# Altium project BodyBasher.PrjPcb
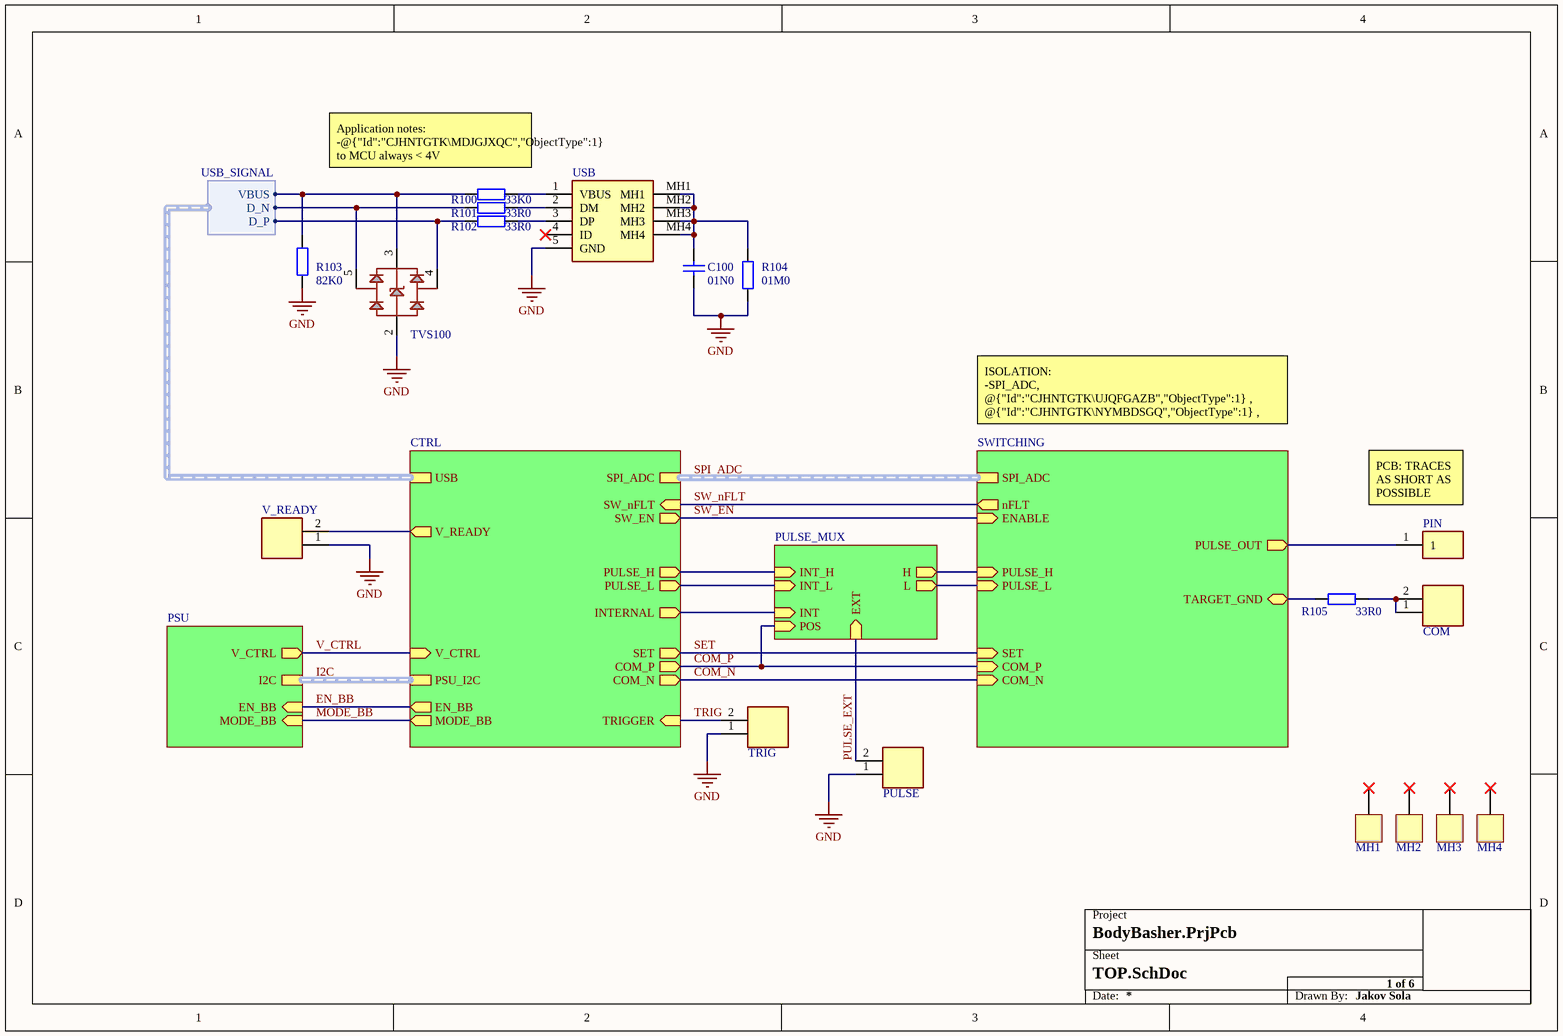
[diagram p0: TOP.SchDoc]
CAGE_CODE: ?????; CONTRACT_NUMBER: <CONTRACT NO>; DOC_NO_ASSY_DWG: <ASSY DWG NO>; DOC_NO_BOM: <BOM DOC NO>; DOC_NO_FAB_DWG: <FAB DWG NO>; DOC_NO_SCH_DWG: <SCH DWG NO>; PCB_2_DEC_TOL: +/-.01; PCB_3_DEC_TOL: +/-.010; PCB_ANG_TOL: +/-1/2; PCB_ASSEMBLY_NO: <PCB ASSY NO>; PCB_CHECKER: - -----; PCB_CHECKER_APP_DATE: --/--/----; PCB_DESIGNER: - -----; PCB_DESIGNER_APP_DATE: --/--/----; PCB_DWG_NO: <PCB DWG NO>; PCB_ENGINEER: - -----; PCB_ENGINEER_APP_DATE: --/--/----; PCB_PART_NUMBER: <PCB PN>; PCB_REV: A; SCH_REV: A
6 sheets, 158 parts. Net scope: hierarchical (ports join the sheet entries above them; power ports are global).
Board file: PCB.PcbDoc
Sheets:
  TOP.SchDoc
    SWITCHING = SWITCHING.SchDoc
      CAP_BANK = CAP_BANK.SchDoc
    PSU = PSU.SchDoc
    CTRL = CTRL.SchDoc
    PULSE_MUX = PULSE_MUX.SchDoc

## Sheet TOP.SchDoc: Body Basher
size A4; CompanyName: COSIC; DrawnBy: Jakov Sola; Engineer: Jakov Sola; SheetNumber: 1; SheetTotal: 6; ENG_APP_DATE: --/--/--; DSN_APP_DATE: --/--/--; CHK_APP_DATE: --/--/--

### Parts
C100  VALUE_4C: 01N0  [CAPC0805N]  (hidden comment: Cap)
COM  CON_2P  [2MMHBS02VT02HTB]  (value not drawn)
MH1  MH  [MH]  (value not drawn)  (no BOM)
MH2  MH  [MH]  (value not drawn)  (no BOM)
MH3  MH  [MH]  (value not drawn)  (no BOM)
MH4  MH  [MH]  (value not drawn)  (no BOM)
PIN  CON_1P  [POGO]  (value not drawn)
PULSE  CON_2P  [2MMHBS02VT02HTB]  (value not drawn)
R100  VALUE_4C: 33K0  [RESC0603N]  (hidden comment: Res)
R101  VALUE_4C: 33R0  [RESC0603N]  (hidden comment: Res)
R102  VALUE_4C: 33R0  [RESC0603N]  (hidden comment: Res)
R103  VALUE_4C: 82K0  [RESC0603N]  (hidden comment: Res)
R104  VALUE_4C: 01M0  [RESC0603N]  (hidden comment: Res)
R105  VALUE_4C: 33R0  [RESC0603N]  (hidden comment: Res)
TRIG  CON_2P  [2MMHBS02VT02HTB]  (value not drawn)
TVS100  SP3003_2X  [SC70_5]  (value not drawn)
USB  microUSB_CON  [476420001]  (value not drawn)
V_READY  CON_2P  [2MMHBS02VT02HTB]  (value not drawn)

### Sub-sheets
CTRL = CTRL.SchDoc: PULSE_H (out), PULSE_L (out), COM_P (out), COM_N (out), SET (out), SPI_ADC (harness SPI_ADC), TRIGGER (in), PSU_I2C (harness I2C), USB (harness USB_SIGNAL), MODE_BB (out), EN_BB (out), V_READY (out), SW_nFLT (in), SW_EN (out), INTERNAL (out), V_CTRL (in)
PSU = PSU.SchDoc: I2C (harness I2C), MODE_BB (in), EN_BB (in), V_CTRL (out)
PULSE_MUX = PULSE_MUX.SchDoc: INT_H (in), INT_L (in), EXT (in), H (out), L (out), INT (in), POS (in)
SWITCHING = SWITCHING.SchDoc: PULSE_H (in), PULSE_L (in), nFLT (out), ENABLE (in), PULSE_OUT (out), COM_P (in), COM_N (in), SET (in), TARGET_GND (bidir), SPI_ADC (harness SPI_ADC)

### Harnesses
USB_SIGNAL: D_P, D_N, VBUS

### Nets
COM: R105.1 ; sheet SWITCHING/TARGET_GND
GND: C100.1 PULSE.1 R103.1 R104.1 TRIG.1 TVS100.2 USB.5(GND) V_READY.1
SW: PIN.1 ; sheet SWITCHING/PULSE_OUT
V_CTRL: sheet PSU/V_CTRL, sheet CTRL/V_CTRL
COM_N: sheet SWITCHING/COM_N, sheet CTRL/COM_N
COM_P: sheet SWITCHING/COM_P, sheet CTRL/COM_P, sheet PULSE_MUX/POS
EN_BB: sheet PSU/EN_BB, sheet CTRL/EN_BB
INT: sheet CTRL/INTERNAL, sheet PULSE_MUX/INT
MODE_BB: sheet PSU/MODE_BB, sheet CTRL/MODE_BB
PULSE_EXT: PULSE.2 ; sheet PULSE_MUX/EXT
PULSE_H: sheet SWITCHING/PULSE_H, sheet CTRL/PULSE_H, sheet PULSE_MUX/INT_H, sheet PULSE_MUX/H
PULSE_L: sheet SWITCHING/PULSE_L, sheet CTRL/PULSE_L, sheet PULSE_MUX/INT_L, sheet PULSE_MUX/L
SET: sheet SWITCHING/SET, sheet CTRL/SET
SW_EN: sheet SWITCHING/ENABLE, sheet CTRL/SW_EN  [project net EN_SW]
SW_nFLT: sheet SWITCHING/nFLT, sheet CTRL/SW_nFLT  [project net nFLT]
TRIG: TRIG.2 ; sheet CTRL/TRIGGER
USB.D_N: R101.1 TVS100.5 ; sheet CTRL/USB.D_N
USB.D_P: R102.1 TVS100.4 ; sheet CTRL/USB.D_P
USB.VBUS: R100.2 R103.2 TVS100.3 ; sheet CTRL/USB.VBUS
V_READY: V_READY.2 ; sheet CTRL/V_READY
NetC100_2: C100.2 R104.2 USB.MH1 USB.MH2 USB.MH3 USB.MH4
NetCOM_1: COM.1 COM.2 R105.2
NetR100_1: R100.1 USB.1(VBUS)
NetR101_2: R101.2 USB.2(DM)
NetR102_2: R102.2 USB.3(DP)

Not connected (* = marked no-connect by the designer): MH1 0(MH)*; MH2 0(MH)*; MH3 0(MH)*; MH4 0(MH)*; USB 4(ID)*

### Buses and harness runs
harness I2C = sheet CTRL/PSU_I2C = sheet PSU/I2C
harness SPI_ADC = sheet CTRL/SPI_ADC = sheet SWITCHING/SPI_ADC

### Notes on the sheet
- Application notes:
  -@{"Id":"CJHNTGTK\MDJGJXQC","ObjectType":1} to MCU always < 4V
  -ESD protection
- ISOLATION:
  -SPI_ADC, @{"Id":"CJHNTGTK\UJQFGAZB","ObjectType":1} , @{"Id":"CJHNTGTK\NYMBDSGQ","ObjectType":1} , @{"Id":"CJHNTGTK\BMOAVTPZ","ObjectType":1} and @{"Id":"CJHNTGTK\TMLSETCT","ObjectType":1} isolated with ISOLATOR
  - @{"Id":"CJHNTGTK\TNVEIYGS","ObjectType":1} , @{"Id":"CJHNTGTK\KZAIASUD","ObjectType":1} and @{"Id":"CJHNTGTK\XAAZLINN","ObjectType":1} isolated with SSR inside SWITCHING
- (near PIN) PCB: TRACES AS SHORT AS POSSIBLE
- Project
- Sheet
- Date:
- Drawn By:

### Library data of the parts
C100 = 2238 600 15623: MANUF: PHYCOMP; DESCR: CAP 01N0 0805 100V X7R 10%; VENDOR: FARNELL INONE; VENDORCODE: 1362553; POPULATE: YES; VALUE_PF: 1000; VOLTAGE: 100V; TOLERANCE: 0.1; MANUFCODE: 2238 600 15623; PACKAGE: 0805; TECHNOLOGY: X7R
COM PULSE TRIG V_READY = 2MM-HB-S02-VT-02-H-TB: MANUF: TE CONNECTIVITY; DESCR: CON 2P 2MM HEADER; VENDOR: MOUSER; VENDORCODE: 571-2MM-HBS02VT02HTB; POPULATE: YES; MANUFCODE: 2MM-HB-S02-VT-02-H-TB
MH1-MH4 = MH: DESCR: MOUNTING HOLE; POPULATE: NA; MANUFCODE: MH
PIN = P25-0123: MANUF: HARWIN; DESCR: POGO PIN 15X5MM; VENDOR: MOUSER; VENDORCODE: 855-P25-0123; POPULATE: YES; MANUFCODE: P25-0123
R100 = CRCW060333K0FKEA: Resistor; MANUF: VISHAY; DESCR: RES 33K0 0603 0.1W 1% 75V 100PPM; VENDOR: DIGI-KEY; VENDORCODE: 541-33.0KHCT-ND; POPULATE: YES; VALUE_MOHM: 33000000; VALUE: 33K; POWER: 0.1W; TOLERANCE: 1%; VOLTAGE: 75V; TEMPCOEFF: 100PPM; NPOWER: 0.1; NTOLERANCE: 0.01; NVOLTAGE: 75; NTEMPCOEFF: 100; MANUFCODE: CRCW060333K0FKEA; PACKAGE: 0603; NVALUE: 33000000
R101 R102 R105 = CRCW060333R0FKEA: Resistor; MANUF: VISHAY; DESCR: RES 33R0 0603 0.1W 1% 75V 100PPM; VENDOR: DIGI-KEY; VENDORCODE: 541-33.0HCT-ND; POPULATE: YES; VALUE_MOHM: 33000; VALUE: 33R; POWER: 0.1W; TOLERANCE: 1%; VOLTAGE: 75V; TEMPCOEFF: 100PPM; NPOWER: 0.1; NTOLERANCE: 0.01; NVOLTAGE: 75; NTEMPCOEFF: 100; MANUFCODE: CRCW060333R0FKEA; PACKAGE: 0603; NVALUE: 33000
R103 = CRCW060382K0FKEA: Resistor; MANUF: VISHAY; DESCR: RES 82K0 0603 0.1W 1% 75V 100PPM; VENDOR: DIGI-KEY; VENDORCODE: 541-82.0KHCT-ND; POPULATE: YES; VALUE_MOHM: 82000000; VALUE: 82K; POWER: 0.1W; TOLERANCE: 1%; VOLTAGE: 75V; TEMPCOEFF: 100PPM; NPOWER: 0.1; NTOLERANCE: 0.01; NVOLTAGE: 75; NTEMPCOEFF: 100; MANUFCODE: CRCW060382K0FKEA; PACKAGE: 0603; NVALUE: 82000000
R104 = MC 0.063W 0603 1% 1M: Resistor; MANUF: MULTICOMP; DESCR: RES 01M0 0603 0.063W 1% 50V 100PPM; VENDOR: FARNELL INONE; VENDORCODE: 9330410; POPULATE: YES; VALUE_MOHM: 1000000000; VALUE: 1M; POWER: 0.063W; TOLERANCE: 1%; VOLTAGE: 50V; TEMPCOEFF: 100PPM; NPOWER: 0.063; NTOLERANCE: 0.01; NVOLTAGE: 50; NTEMPCOEFF: 100; MANUFCODE: MC 0.063W 0603 1% 1M; PACKAGE: 0603; NVALUE: 1000000000
TVS100 = SP3003-02JTG: MANUF: LITTELFUSE; DESCR: DIODE TVS DUAL 0.65PF SC70-5; VENDOR: DIGI-KEY; VENDORCODE: 1827640; POPULATE: YES; MANUFCODE: SP3003-02JTG; TYPE: TVS_BIDIR; QTY: DUAL; PACKAGE: SC70_5
USB = 47642-0001: MANUF: MOLEX; DESCR: CON MICRO USB 5P SMD; VENDOR: MOUSER; VENDORCODE: 538-47642-0001; POPULATE: YES; MANUFCODE: 47642-0001

## Sheet SWITCHING.SchDoc
size A4; DrawnBy: Jakov Sola; SheetNumber: 4; SheetTotal: 6
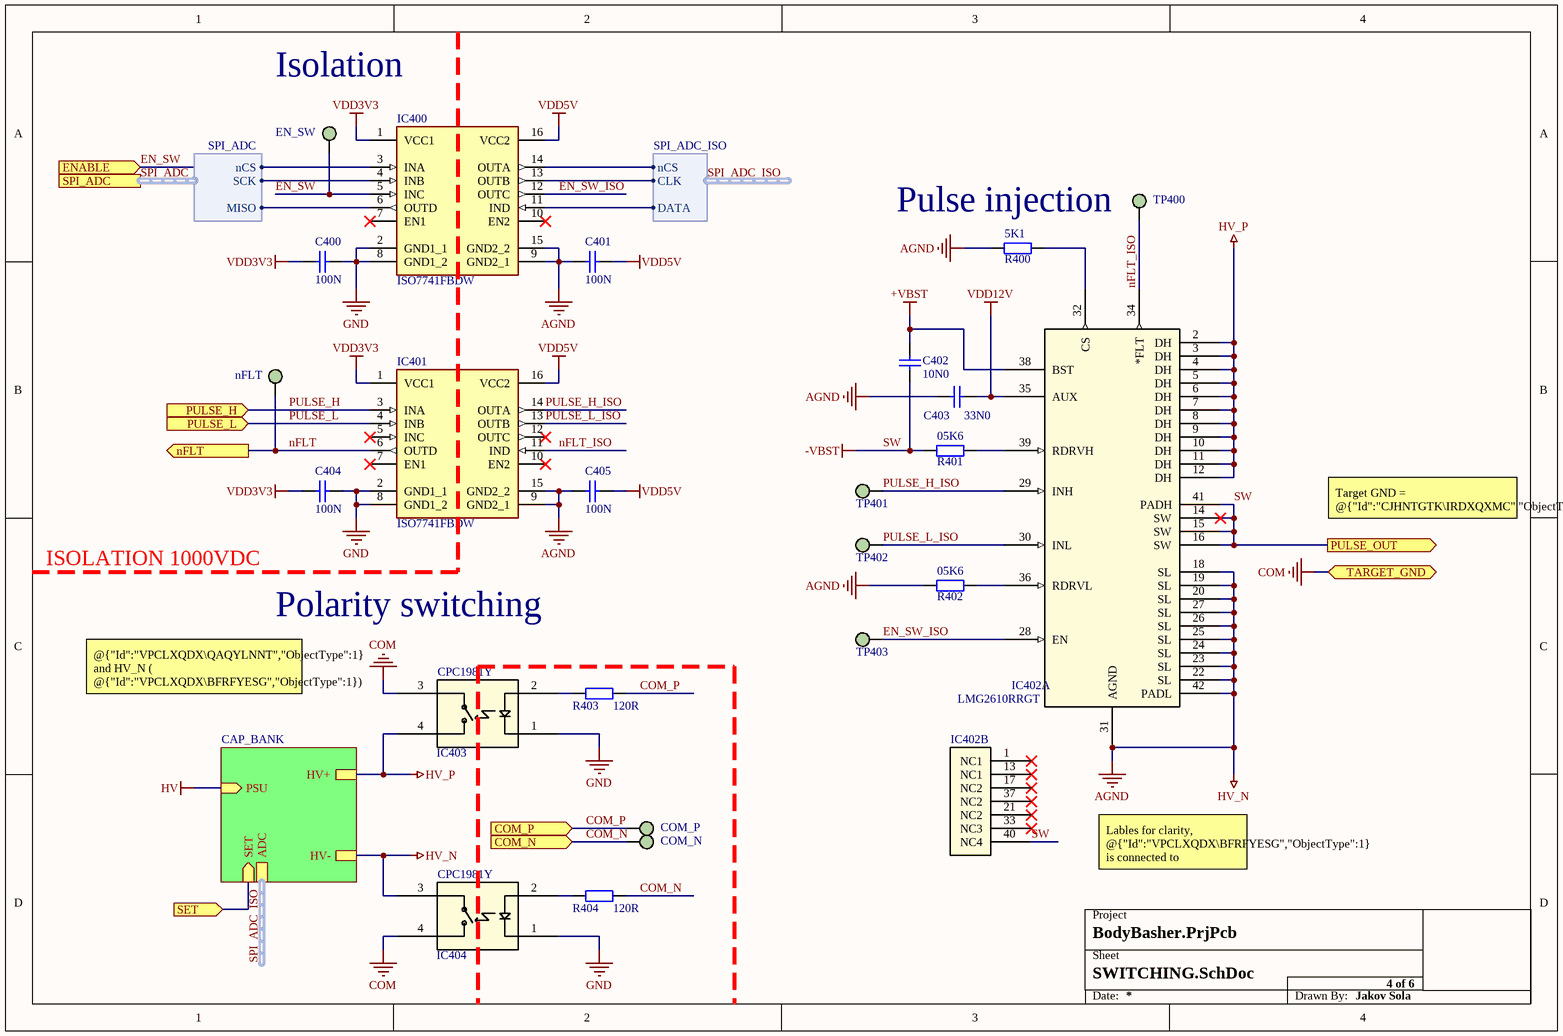
[diagram p1: SWITCHING.SchDoc]

### Parts
C400  VALUE_4C: 100N  [CAPC0603N]  (hidden comment: Cap)
C401  VALUE_4C: 100N  [CAPC0603N]  (hidden comment: Cap)
C402  VALUE_4C: 10N0  [CAPC0603N]  (hidden comment: Cap)
C403  VALUE_4C: 33N0  [CAPC0603N]  (hidden comment: Cap)
C404  VALUE_4C: 100N  [CAPC0603N]  (hidden comment: Cap)
C405  VALUE_4C: 100N  [CAPC0603N]  (hidden comment: Cap)
COM_N  TP  [TP]  (value not drawn)
COM_P  TP  [TP]  (value not drawn)
EN_SW  TP  [TP]  (value not drawn)
IC400  ISO7741FBDW  [SOIC16]
IC401  ISO7741FBDW  [SOIC16]
IC402  LMG2610RRGT  [XLMG2610RRGT]  (parts A,B of 2)
IC403  SSR_SPST_NO  [CPC1981Y]  (value not drawn)
IC404  SSR_SPST_NO  [CPC1981Y]  (value not drawn)
nFLT  TP  [TP]  (value not drawn)
R400  value 5K1  [RESC0603N]  (hidden comment: Res)
R401  VALUE_4C: 05K6  [RESC0603N]  (hidden comment: Res)
R402  VALUE_4C: 05K6  [RESC0603N]  (hidden comment: Res)
R403  VALUE_4C: 120R  [RESC0603N]  (hidden comment: Res)
R404  VALUE_4C: 120R  [RESC0603N]  (hidden comment: Res)
TP400  TP  [TP]  (value not drawn)
TP401  TP  [TP]  (value not drawn)
TP402  TP  [TP]  (value not drawn)
TP403  TP  [TP]  (value not drawn)

### Sub-sheets
CAP_BANK = CAP_BANK.SchDoc: PSU (in), ADC (harness SPI_ADC), SET (in), HV+, HV-

### Ports
COM_N (in), COM_P (in), ENABLE (in), nFLT (out), PULSE_H (in), PULSE_L (in), PULSE_OUT (out), SET (in), SPI_ADC (harness SPI_ADC), TARGET_GND (bidir)

### Harnesses
SPI_ADC_ISO: nCS, DATA, CLK
SPI_ADC: nCS, SCK, MISO

### Nets
+VBST: C402.2 IC402.38(BST)
AGND: C401.2 C403.1 C405.2 IC400.9(GND2_1) IC400.15(GND2_2) IC401.9(GND2_1) IC401.15(GND2_2) IC402.18(SL) IC402.19(SL) IC402.20(SL) IC402.22(SL) IC402.23(SL) IC402.24(SL) IC402.25(SL) IC402.26(SL) IC402.27(SL) IC402.31(AGND) IC402.42(PADL) IC404.3(NOCL1) R400.1 R402.1 ; sheet CAP_BANK/HV-  [also labelled HV_N]
COM: IC403.3(NOCL1) IC404.4(NOOP2) ; port TARGET_GND
GND: C400.1 C404.1 IC400.2(GND1_1) IC400.8(GND1_2) IC401.2(GND1_1) IC401.8(GND1_2) IC403.1(-) IC404.1(-)
HV_P: IC402.2(DH) IC402.3(DH) IC402.4(DH) IC402.5(DH) IC402.6(DH) IC402.7(DH) IC402.8(DH) IC402.9(DH) IC402.10(DH) IC402.11(DH) IC402.12(DH) IC403.4(NOOP2) ; sheet CAP_BANK/HV+
SW: C402.1 IC402.14(SW) IC402.15(SW) IC402.16(SW) IC402.40(NC4) IC402.41(PADH) R401.1 ; port PULSE_OUT  [also labelled -VBST]
VDD3V3: C400.2 C404.2 IC400.1(VCC1) IC401.1(VCC1)
VDD5V: C401.1 C405.1 IC400.16(VCC2) IC401.16(VCC2)
VDD12V: C403.2 IC402.35(AUX)
COM_N: COM_N.TP R404.2 ; port COM_N
COM_P: COM_P.TP R403.2 ; port COM_P
EN_SW: EN_SW.TP IC400.5(INC) ; port ENABLE
EN_SW_ISO: IC400.12(OUTC) IC402.28(EN) TP403.TP
nFLT: IC401.6(OUTD) nFLT.TP ; port nFLT
nFLT_ISO: IC401.11(IND) IC402.34(*FLT) TP400.TP
PULSE_H: IC401.3(INA) ; port PULSE_H
PULSE_H_ISO: IC401.14(OUTA) IC402.29(INH) TP401.TP
PULSE_L: IC401.4(INB) ; port PULSE_L
PULSE_L_ISO: IC401.13(OUTB) IC402.30(INL) TP402.TP
SET: port SET, sheet CAP_BANK/SET
SPI_ADC.MISO: IC400.6(OUTD) ; port SPI_ADC.MISO
SPI_ADC.nCS: IC400.3(INA) ; port SPI_ADC.nCS
SPI_ADC.SCK: IC400.4(INB) ; port SPI_ADC.SCK
SPI_ADC_ISO.CLK: IC400.13(OUTB) ; sheet CAP_BANK/ADC.CLK
SPI_ADC_ISO.DATA: IC400.11(IND) ; sheet CAP_BANK/ADC.DATA
SPI_ADC_ISO.nCS: IC400.14(OUTA) ; sheet CAP_BANK/ADC.nCS
NetIC402_32: IC402.32(CS) R400.2
NetIC402_36: IC402.36(RDRVL) R402.2
NetIC402_39: IC402.39(RDRVH) R401.2
NetIC403_2: IC403.2(+) R403.1
NetIC404_2: IC404.2(+) R404.1

Not connected (* = marked no-connect by the designer): IC400 7(EN1)* 10(EN2)*; IC401 5(INC)* 7(EN1)* 10(EN2)* 12(OUTC)*; IC402 1(NC1)* 13(NC1)* 17(NC2)* 21(NC2)* 33(NC3)* 37(NC2)*

### Buses and harness runs
harness SPI_ADC = port SPI_ADC
harness SPI_ADC_ISO = sheet CAP_BANK/ADC

### Notes on the sheet
- Isolation
- (near TP400) Pulse injection
- Target GND = @{"Id":"CJHNTGTK\IRDXQXMC","ObjectType":1}
  Keep traces as short as possible
- ISOLATION 1000VDC
- Polarity switching
- @{"Id":"VPCLXQDX\QAQYLNNT","ObjectType":1}  and HV_N ( @{"Id":"VPCLXQDX\BFRFYESG","ObjectType":1}) never connected to @{"Id":"CJHNTGTK\IRDXQXMC","ObjectType":1} at the same time
  Take into account t_on and t_off.
- Lables for clarity, @{"Id":"VPCLXQDX\BFRFYESG","ObjectType":1} is connected to @{"Id":"XTKKVGUJ\YZZHXVUT","ObjectType":2} in CAP_BANK
- Project
- Sheet
- Date:
- Drawn By:

### Library data of the parts
C400 C401 C404 C405 = CL10B104KA8WPNC: MANUF: SAMSUNG; DESCR: CAP 100N 0603 25V X7R 10%; VENDOR: DIGI-KEY; VENDORCODE: 1276-6717-1-ND; POPULATE: YES; VALUE: 100N; VOLTAGE: 25V; TOLERANCE: 0.1; MANUFCODE: CL10B104KA8WPNC; PACKAGE: 0603; TECHNOLOGY: X7R
C402 = CGA3E2C0G1H103J080AA: MANUF: TDK; DESCR: CAP 10N0 0603 50V NP0 5%; VENDOR: FARNELL INONE; VENDORCODE: 2210846; POPULATE: YES; VALUE_PF: 10000; VALUE: 10N; VOLTAGE: 50V; TOLERANCE: 0.05; MANUFCODE: CGA3E2C0G1H103J080AA; PACKAGE: 0603; TECHNOLOGY: NP0
C403 = CL10B333KB8NFNC: MANUF: SAMSUNG; DESCR: CAP 33N0 0603 50V X7R 10%; VENDOR: DIGI-KEY; VENDORCODE: 1276-2040-1-ND; POPULATE: YES; VALUE: 33N; VOLTAGE: 50V; TOLERANCE: 0.1; MANUFCODE: CL10B333KB8NFNC; PACKAGE: 0603; TECHNOLOGY: X7R
COM_N COM_P EN_SW nFLT TP400-TP403 = TP: DESCR: TESTPOINT 1.5MM; POPULATE: NA; MANUFCODE: TP
IC400 IC401 = ISO7741FBDW: MANUF: TI; DESCR: IC ISO 3/1 100MBPS 2.25-5.5 V; VENDOR: MOUSER; VENDORCODE: 595-ISO7741FBDW; POPULATE: YES; MANUFCODE: ISO7741FBDW
IC402 = LMG2610RRGT: MANUF: TEXAS INSTRUMENTS; DESCR: IC INT HALF BRIDGE GAN; VENDOR: MOUSER; VENDORCODE: 595-LMG2610RRGT; POPULATE: YES; MANUFCODE: LMG2610RRGT
IC403 IC404 = CPC1981Y: MANUF: IXYS; DESCR: IC SSR SPST NO 1000V 180mA; VENDOR: MOUSER; VENDORCODE: 849-CPC1981Y; POPULATE: YES; MANUFCODE: CPC1981Y
R400 = MC 0.063W 0603 1% 5K1: Resistor; MANUF: MULTICOMP; DESCR: RES 05K1 0603 0.063W 1% 50V 100PPM; VENDOR: FARNELL INONE; VENDORCODE: 9331301; POPULATE: YES; VALUE_MOHM: 5100000; VALUE_4C: 05K1; POWER: 0.063W; TOLERANCE: 1%; VOLTAGE: 50V; TEMPCOEFF: 100PPM; NPOWER: 0.063; NTOLERANCE: 0.01; NVOLTAGE: 50; NTEMPCOEFF: 100; MANUFCODE: MC 0.063W 0603 1% 5K1; PACKAGE: 0603; NVALUE: 5100000
R401 R402 = MC 0.063W 0603 1% 5K6: Resistor; MANUF: MULTICOMP; DESCR: RES 05K6 0603 0.063W 1% 50V 100PPM; VENDOR: FARNELL INONE; VENDORCODE: 9331352; POPULATE: YES; VALUE_MOHM: 5600000; VALUE: 5K6; POWER: 0.063W; TOLERANCE: 1%; VOLTAGE: 50V; TEMPCOEFF: 100PPM; NPOWER: 0.063; NTOLERANCE: 0.01; NVOLTAGE: 50; NTEMPCOEFF: 100; MANUFCODE: MC 0.063W 0603 1% 5K6; PACKAGE: 0603; NVALUE: 5600000
R403 R404 = CRCW0603120RFKEA: Resistor; MANUF: VISHAY; DESCR: RES 120R 0603 0.1W 1% 75V 100PPM; VENDOR: DIGI-KEY; VENDORCODE: 541-120HCT-ND; POPULATE: YES; VALUE_MOHM: 120000; VALUE: 120R; POWER: 0.1W; TOLERANCE: 1%; VOLTAGE: 75V; TEMPCOEFF: 100PPM; NPOWER: 0.1; NTOLERANCE: 0.01; NVOLTAGE: 75; NTEMPCOEFF: 100; MANUFCODE: CRCW0603120RFKEA; PACKAGE: 0603; NVALUE: 120000

## Sheet CAP_BANK.SchDoc
size A4; DrawnBy: Jakov Sola; SheetNumber: 5; SheetTotal: 6
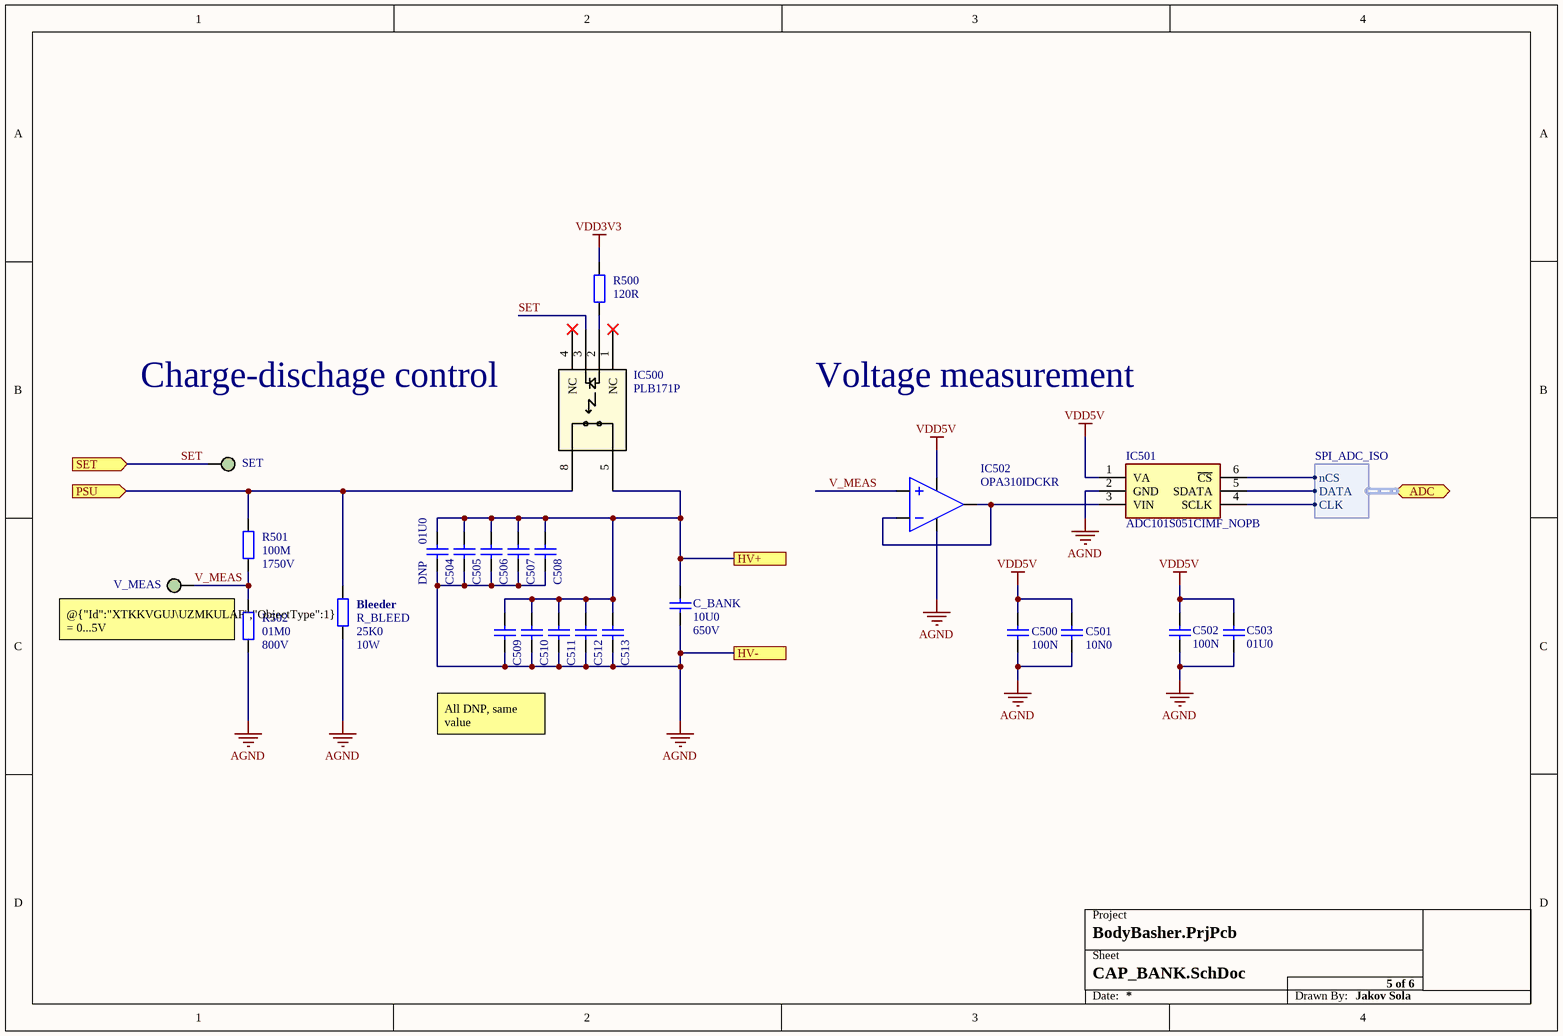
[diagram p2: CAP_BANK.SchDoc]

### Parts
C500  VALUE_4C: 100N  [CAPC0603N]  (hidden comment: Cap)
C501  VALUE_4C: 10N0  [CAPC0603N]  (hidden comment: Cap)
C502  VALUE_4C: 100N  [CAPC0603N]  (hidden comment: Cap)
C503  VALUE_4C: 01U0  [CAPC0603N]  (hidden comment: Cap)
C504  POPULATE: DNP  VALUE_4C: 01U0  [CAPC2220N]  (hidden comment: Cap)
C505  Cap  [CAPC2220N]  (value not drawn)
C506  Cap  [CAPC2220N]  (value not drawn)
C507  Cap  [CAPC2220N]  (value not drawn)
C508  Cap  [CAPC2220N]  (value not drawn)
C509  Cap  [CAPC2220N]  (value not drawn)
C510  Cap  [CAPC2220N]  (value not drawn)
C511  Cap  [CAPC2220N]  (value not drawn)
C512  Cap  [CAPC2220N]  (value not drawn)
C513  Cap  [CAPC2220N]  (value not drawn)
C_BANK  VALUE_4C: 10U0  VOLTAGE: 650V  [CAP_TH_15MM_RADIAL_30X58MM]  (hidden comment: Cap)
IC500  SSR_SPST_NC  [PLB171P]  (value not drawn)
IC501  ADC101S051CIMF_NOPB  [SOT95P280X145-6N]
IC502  OPA310IDCKR  [SOT65P210X110-5N]
R500  VALUE_4C: 120R  [RESC0603N]  (hidden comment: Res)
R501  VALUE_4C: 100M  VOLTAGE: 1750V  [RESC1210N]  (hidden comment: Res)
R502  VALUE_4C: 01M0  VOLTAGE: 800V  [RESC1210N]  (hidden comment: Res)
R_BLEED  VALUE_4C: 25K0  POWER: 10W  [RESAD8333W107L4521D953]  (hidden comment: Res)
SET  TP  [TP]  (value not drawn)
V_MEAS  TP  [TP]  (value not drawn)

### Ports
ADC (bidir, harness SPI_ADC_ISO), HV+, HV-, PSU (in), SET (in)

### Harnesses
SPI_ADC_ISO: nCS, DATA, CLK

### Nets
AGND: C500.2 C501.1 C502.2 C503.1 C504.1 C505.1 C506.1 C507.1 C508.1 C509.1 C510.1 C511.1 C512.1 C513.1 C_BANK.1 IC501.2(GND) IC502.2(V-) R502.1 R_BLEED.1 ; port HV-
HV: IC500.8(NOOP2) R501.2 R_BLEED.2 ; port PSU
HV_P: C504.2 C505.2 C506.2 C507.2 C508.2 C509.2 C510.2 C511.2 C512.2 C513.2 C_BANK.2 IC500.5(NOCL1) ; port HV+
VDD3V3: R500.2
VDD5V: C500.1 C501.2 C502.1 C503.2 IC501.1(VA) IC502.5(V+)
SET: IC500.3(-) SET.TP ; port SET
SPI_ADC_ISO.CLK: IC501.4(SCLK) ; port ADC.CLK
SPI_ADC_ISO.DATA: IC501.5(SDATA) ; port ADC.DATA
SPI_ADC_ISO.nCS: IC501.6(~{CS}) ; port ADC.nCS
V_MEAS: IC502.1(IN+) R501.1 R502.2 V_MEAS.TP
NetIC500_2: IC500.2(+) R500.1
NetIC501_3: IC501.3(VIN) IC502.3(IN-) IC502.4(OUT)

Not connected (* = marked no-connect by the designer): IC500 1(NC)* 4(NC)*

### Notes on the sheet
- (near IC500) Charge-dischage control
- Voltage measurement
- @{"Id":"XTKKVGUJ\UZMKULAF","ObjectType":1} = 0...5V
  Imax = 500V/101MOhm = 5uA
- (near R_BLEED) Bleeder
- All DNP, same value
- Project
- Sheet
- Date:
- Drawn By:

### Library data of the parts
C500 C502 = CL10B104KA8WPNC: as C400 on sheet SWITCHING; MANUFCODE: CL10B104KA8WPNC; PACKAGE: 0603; TECHNOLOGY: X7R
C501 = C0603C103K8RACTU: MANUF: KEMET; DESCR: CAP 10N0 0603 10V X7R 10%; VENDOR: DIGI-KEY; VENDORCODE: 399-11132-1-ND; POPULATE: YES; VALUE: 10N; VOLTAGE: 10V; TOLERANCE: 0.1; MANUFCODE: C0603C103K8RACTU; PACKAGE: 0603; TECHNOLOGY: X7R
C503 = C0603C105K3PAC: MANUF: KEMET; DESCR: CAP 01U0 0603 25V X5R 10%; VENDOR: FARNELL INONE; VENDORCODE: 1288202; POPULATE: YES; VALUE_PF: 1000000; VOLTAGE: 25V; TOLERANCE: 0.1; MANUFCODE: C0603C105K3PAC; PACKAGE: 0603; TECHNOLOGY: X5R
C504 = 2220CC105KAZ2A: MANUF: KOYCERA; DESCR: CAP 01U0 2220 600V X7R 10%; VENDOR: MOUSER; VENDORCODE: 581-2220CC105KAZ2A; VALUE_PF: 1000000; VALUE: 1U; VOLTAGE: 600V; TOLERANCE: 0.1; MANUFCODE: 2220CC105KAZ2A; PACKAGE: 2220; TECHNOLOGY: X7R
C505-C513 = 2220CC105KAZ2A: MANUF: KOYCERA; DESCR: CAP 01U0 2220 600V X7R 10%; VENDOR: MOUSER; VENDORCODE: 581-2220CC105KAZ2A; POPULATE: DNP; VALUE_PF: 1000000; VALUE: 1U; VALUE_4C: 01U0; VOLTAGE: 600V; TOLERANCE: 0.1; MANUFCODE: 2220CC105KAZ2A; PACKAGE: 2220; TECHNOLOGY: X7R
C_BANK = B32928A4106K000: MANUF: EPCOS; DESCR: CAP 10U 30X58 650V PP 10%; VENDOR: MOUSER; VENDORCODE: 871-B32928A4106K000; POPULATE: YES; VALUE_PF: 10000000; VALUE: 10U; TOLERANCE: 0.1; MANUFCODE: B32928A4106K000; PACKAGE: 30X58
IC500 = PLB171P: Solid State SPST-NC (1 Form B) 8-SMD (0.300", 7.62mm), 6 Leads; MANUF: IXYS; DESCR: IC SSR SPST NC 800V 80mA; VENDOR: MOUSER; VENDORCODE: 849-PLB171P; POPULATE: YES; MANUFCODE: PLB171P
IC501 = ADC101S051CIMF/NOPB: MANUF: TI; DESCR: IC ADC 10B 500KSPS SPI; VENDOR: MOUSER; VENDORCODE: 926-AD101S051CIMFNPB; POPULATE: YES; MANUFCODE: ADC101S051CIMF/NOPB
IC502 = OPA310IDCKR: MANUF: TI; DESCR: IC OPAMP 5.5V 3MHz; VENDOR: MOUSER; VENDORCODE: 595-OPA310IDCKR; POPULATE: YES; MANUFCODE: OPA310IDCKR
R500 = CRCW0603120RFKEA: as R403 on sheet SWITCHING; MANUFCODE: CRCW0603120RFKEA; PACKAGE: 0603; NVALUE: 120000
R501 = CRHA1210AF100MFKEF: Resistor; MANUF: VISHAY; DESCR: RES 100M 1210 0.45W 1% 1750V 100PPM; VENDOR: MOUSER; VENDORCODE: 71-CRHA1210A100MFKEF; POPULATE: YES; VALUE_MOHM: 10000000000; VALUE: 100M; POWER: 0.45W; TOLERANCE: 1%; TEMPCOEFF: 100PPM; NPOWER: 0.45; NTOLERANCE: 0.01; NVOLTAGE: 1750; NTEMPCOEFF: 100; MANUFCODE: CRHA1210AF100MFKEF; PACKAGE: 1210; NVALUE: 10000000000
R502 = RCV12061M00FKEAAT: Resistor; MANUF: VISHAY; DESCR: RES 1M 1210 0.25W 1% 800V 100PPM; VENDOR: MOUSER; VENDORCODE: 71-RCV12061M00FKEAAT; POPULATE: YES; VALUE_MOHM: 100000000; VALUE: 1M; POWER: 0.25W; TOLERANCE: 1%; TEMPCOEFF: 100PPM; NPOWER: 0.25; NTOLERANCE: 0.01; NVOLTAGE: 800; NTEMPCOEFF: 100; MANUFCODE: RCV12061M00FKEAAT; PACKAGE: 1210; NVALUE: 100000000
R_BLEED = RS01025K00FE73: Resistor; MANUF: VISHAY; DESCR: RES 25K AXIAL 10W 1% 20PPM; VENDOR: MOUSER; VENDORCODE: 71-RS01025K00FE73; POPULATE: YES; VALUE_MOHM: 25000000; VALUE: 25K; TOLERANCE: 1%; TEMPCOEFF: 20PPM; NPOWER: 10; NTOLERANCE: 0.01; NTEMPCOEFF: 20; MANUFCODE: RS01025K00FE73; PACKAGE: AXIAL; NVALUE: 25000000
SET V_MEAS = TP: DESCR: TESTPOINT 1.5MM; POPULATE: NA; MANUFCODE: TP

## Sheet PSU.SchDoc
size A4; DrawnBy: Jakov Sola; SheetNumber: 6; SheetTotal: 6
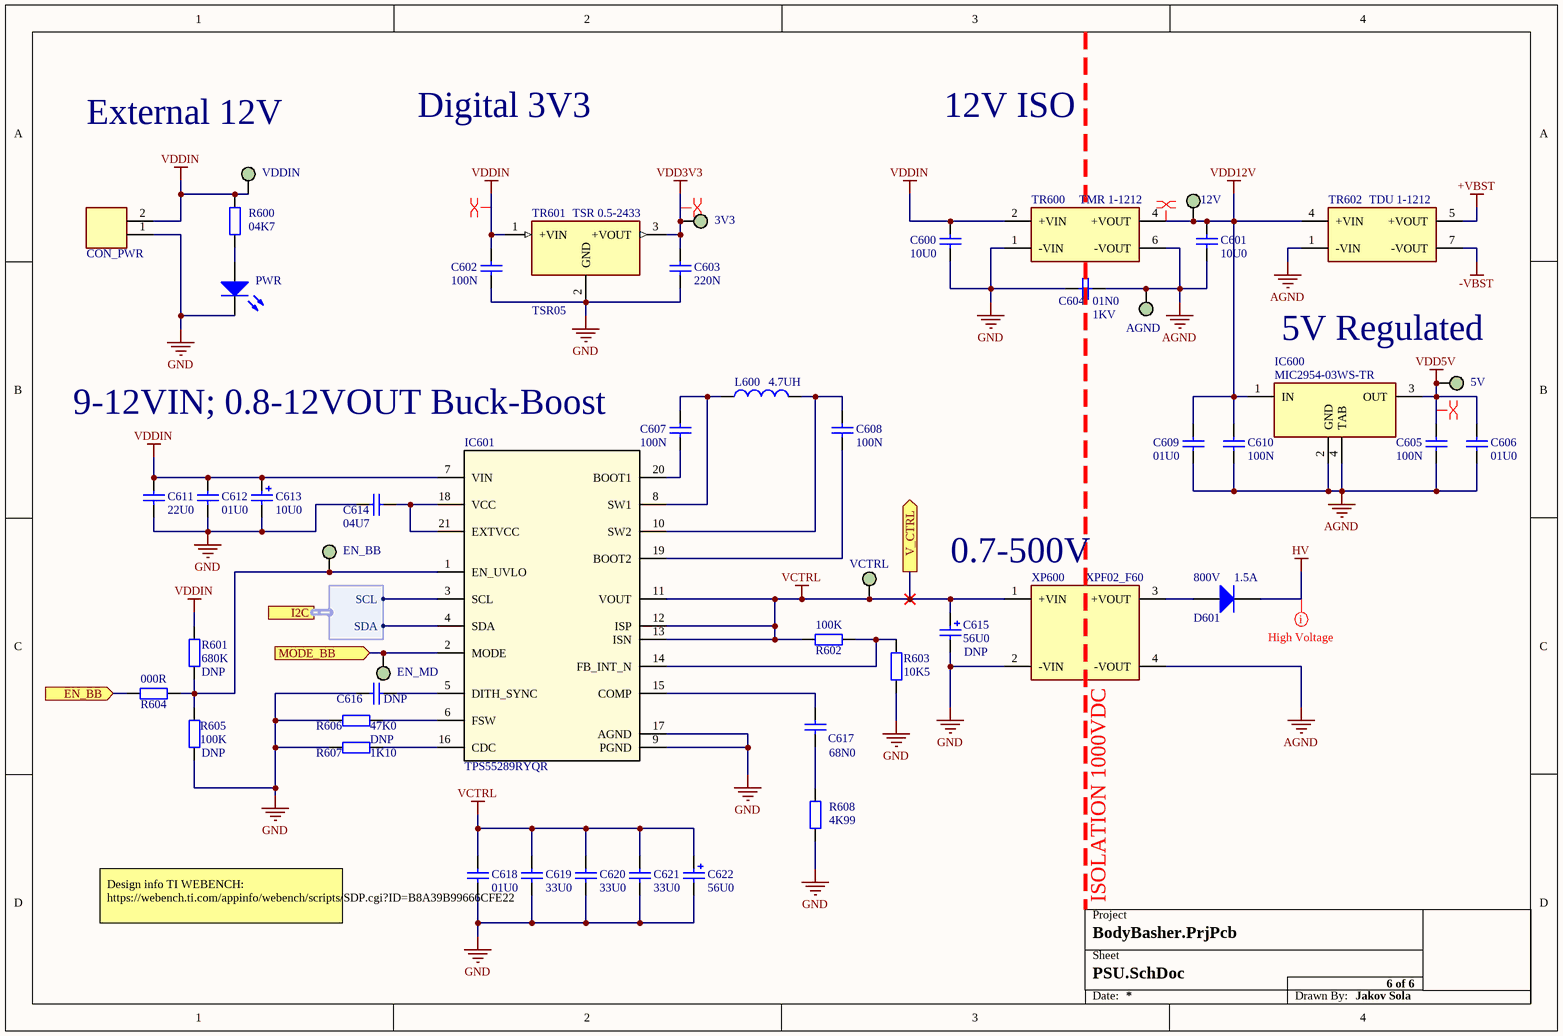
[diagram p3: PSU.SchDoc]

### Parts
3V3  TP  [TP]  (value not drawn)
5V  TP  [TP]  (value not drawn)
12V  TP  [TP]  (value not drawn)
AGND  TP  [TP]  (value not drawn)
C600  VALUE_4C: 10U0  [CAPC0603N]  (hidden comment: Cap)
C601  VALUE_4C: 10U0  [CAPC0603N]  (hidden comment: Cap)
C602  VALUE_4C: 100N  [CAPC0603N]  (hidden comment: Cap)
C603  VALUE_4C: 220N  [CAPC0603N]  (hidden comment: Cap)
C604  VALUE_4C: 01N0  VOLTAGE: 1KV  [CAPC1206N]  (hidden comment: Cap)
C605  VALUE_4C: 100N  [CAPC0603N]  (hidden comment: Cap)
C606  VALUE_4C: 01U0  [CAPC0603N]  (hidden comment: Cap)
C607  VALUE_4C: 100N  [CAPC0603N]  (hidden comment: Cap)
C608  VALUE_4C: 100N  [CAPC0603N]  (hidden comment: Cap)
C609  VALUE_4C: 01U0  [CAPC0603N]  (hidden comment: Cap)
C610  VALUE_4C: 100N  [CAPC0603N]  (hidden comment: Cap)
C611  VALUE_4C: 22U0  [CAPC1206N]  (hidden comment: Cap)
C612  VALUE_4C: 01U0  [CAPC0603N]  (hidden comment: Cap)
C613  VALUE_4C: 10U0  [C]  (hidden comment: CapPol)
C614  VALUE_4C: 04U7  [CAPC0603N]  (hidden comment: Cap)
C615  POPULATE: DNP  VALUE_4C: 56U0  [20SVPF56MX]  (hidden comment: CapPol)
C616  POPULATE: DNP  [CAPC0603N]  (hidden comment: Cap)
C617  VALUE_4C: 68N0  [CAPC0603N]  (hidden comment: Cap)
C618  VALUE_4C: 01U0  [CAPC0603N]  (hidden comment: Cap)
C619  VALUE_4C: 33U0  [CAPC1206N]  (hidden comment: Cap)
C620  VALUE_4C: 33U0  [CAPC1206N]  (hidden comment: Cap)
C621  VALUE_4C: 33U0  [CAPC1206N]  (hidden comment: Cap)
C622  VALUE_4C: 56U0  [20SVPF56MX]  (hidden comment: CapPol)
CON_PWR  CON_2P  [1711725]  (value not drawn)
D601  IF: 1.5A  VR: 800V  [DIOSMB]  (hidden comment: Diode)
EN_BB  TP  [TP]  (value not drawn)
EN_MD  TP  [TP]  (value not drawn)
IC600  MIC2954-03WS-TR  [SOT230P700X180-4N]
IC601  TPS55289RYQR  [RYQ0021A-MFG]
L600  INDUCTANCE: 4.7UH  [SRN80404R7Y]  (hidden comment: Inductor)
PWR  LED  [LED0603_GREEN]  (value not drawn)
R600  VALUE_4C: 04K7  [RESC0603N]  (hidden comment: Res)
R601  POPULATE: DNP  VALUE_4C: 680K  [RESC0603N]  (hidden comment: Res)
R602  VALUE_4C: 100K  [RESC0603N]  (hidden comment: Res)
R603  VALUE_4C: 10K5  [RESC0603N]  (hidden comment: Res)
R604  VALUE_4C: 000R  [RESC0603N]  (hidden comment: Res)
R605  POPULATE: DNP  VALUE_4C: 100K  [RESC0603N]  (hidden comment: Res)
R606  VALUE_4C: 47K0  [RESC0603N]  (hidden comment: Res)
R607  POPULATE: DNP  VALUE_4C: 1K10  [RESC0603N]  (hidden comment: Res)
R608  VALUE_4C: 4K99  [RESC0603N]  (hidden comment: Res)
TR600  MANUFCODE: TMR 1-1212  [TMR1]  (hidden comment: TMR1)
TR601  TSR05  MANUFCODE: TSR 0.5-2433  [TSR05]
TR602  MANUFCODE: TDU 1-1212  [TDU1]  (hidden comment: TDU1)
VCTRL  TP  [TP]  (value not drawn)
VDDIN  TP  [TP]  (value not drawn)
XP600  XPF02_F60  [XPF02_F60]

### Ports
EN_BB (in), I2C (harness I2C), MODE_BB (in), V_CTRL (out)

### Harnesses
I2C: SCL, SDA

### Nets
+VBST: TR602.5(+VOUT)
-VBST: TR602.7(-VOUT)  [project net SW]
AGND: AGND.TP C601.1 C604.2 C605.1 C606.1 C609.1 C610.1 IC600.2(GND) IC600.4(TAB) TR600.6(-VOUT) TR602.1(-VIN) XP600.4(-VOUT)
GND: C600.1 C602.1 C603.1 C604.1 C611.1 C612.1 C613.2 C614.1 C615.2 C616.2 C618.1 C619.1 C620.1 C621.1 C622.2 CON_PWR.1 IC601.9(PGND) IC601.17(AGND) PWR.2(K) R603.2 R605.1 R606.2 R607.1 R608.1 TR600.1(-VIN) TR601.2(GND) XP600.2(-VIN)
HV: D601.2(K)
VCTRL: C615.1 C618.2 C619.2 C620.2 C621.2 C622.1 IC601.11(VOUT) IC601.12(ISP) IC601.13(ISN) R602.1 VCTRL.TP XP600.1(+VIN) ; port V_CTRL  [project net V_CTRL]
VDD3V3: 3V3.TP C603.2 TR601.3(+VOUT)
VDD5V: 5V.TP C605.2 C606.2 IC600.3(OUT)
VDD12V: 12V.TP C601.2 C609.2 C610.2 IC600.1(IN) TR600.4(+VOUT) TR602.4(+VIN)
VDDIN: C600.2 C602.2 C611.2 C612.2 C613.1 CON_PWR.2 IC601.7(VIN) R600.2 R601.2 TR600.2(+VIN) TR601.1(+VIN) VDDIN.TP
EN_BB: R604.1 ; port EN_BB
I2C.SCL: IC601.3(SCL) ; port I2C.SCL
I2C.SDA: IC601.4(SDA) ; port I2C.SDA
MODE_BB: EN_MD.TP IC601.2(MODE) ; port MODE_BB
NetC607_1: C607.1 IC601.20(BOOT1)
NetC607_2: C607.2 IC601.8(SW1) L600.1
NetC608_1: C608.1 IC601.19(BOOT2)
NetC608_2: C608.2 IC601.10(SW2) L600.2
NetC614_2: C614.2 IC601.18(VCC) IC601.21(EXTVCC)
NetC616_1: C616.1 IC601.5(DITH_SYNC)
NetC617_1: C617.1 R608.2
NetC617_2: C617.2 IC601.15(COMP)
NetD601_1: D601.1(A) XP600.3(+VOUT)
NetEN_BB_TP: EN_BB.TP IC601.1(EN_UVLO) R601.1 R604.2 R605.2
NetIC601_6: IC601.6(FSW) R606.1
NetIC601_14: IC601.14(FB_INT_N) R602.2 R603.1
NetIC601_16: IC601.16(CDC) R607.2
NetPWR_1: PWR.1(A) R600.1

### Layout directives
mark named High Voltage: HV
rule Supply Nets [Voltage = 3.300]: VDD3V3, VDD5V
rule Supply Nets [Voltage = 12.00]: VDDIN
rule Supply Nets [Voltage = 5.000]: VDD12V

### Notes on the sheet
- External 12V
- Digital 3V3
- 12V ISO
- 5V Regulated
- 9-12VIN; 0.8-12VOUT Buck-Boost
- (near XP600) 0.7-500V
- Design info TI WEBENCH:
  https://webench.ti.com/appinfo/webench/scripts/SDP.cgi?ID=B8A39B99666CFE22
- (near XP600) ISOLATION 1000VDC
- Project
- Sheet
- Date:
- Drawn By:

### Library data of the parts
3V3 5V 12V AGND EN_BB EN_MD VCTRL VDDIN = TP: DESCR: TESTPOINT 1.5MM; POPULATE: NA; MANUFCODE: TP
C600 C601 = ZRB18AR61E106ME01L: MANUF: MURATA; DESCR: CAP 10U0 0603 25V X5R 20%; VENDOR: FARNELL INONE; VENDORCODE: 2469398; POPULATE: YES; VALUE_PF: 10000000; VALUE: 10U; VOLTAGE: 25V; TOLERANCE: 0.2; MANUFCODE: ZRB18AR61E106ME01L; PACKAGE: 0603; TECHNOLOGY: X5R
C602 C605 C607 C608 C610 = CL10B104KA8WPNC: as C400 on sheet SWITCHING; MANUFCODE: CL10B104KA8WPNC; PACKAGE: 0603; TECHNOLOGY: X7R
C603 = AC0603KRX7R6BB224: MANUF: YAGEO; DESCR: CAP 220N 0603 10V X7R 10%; VENDOR: DIGI-KEY; VENDORCODE: 311-3103-1-ND; POPULATE: YES; VALUE: 220N; VOLTAGE: 10V; TOLERANCE: 0.1; MANUFCODE: AC0603KRX7R6BB224; PACKAGE: 0603; TECHNOLOGY: X7R
C604 = 1206AC102KAT2A: MANUF: AVX; DESCR: CAP 01N0 1206 1KV X7R 10%; VENDOR: FARNELL INONE; VENDORCODE: 1216463; POPULATE: YES; VALUE_PF: 1000; TOLERANCE: 0.1; MANUFCODE: 1206AC102KAT2A; PACKAGE: 1206; TECHNOLOGY: X7R
C606 C609 = C0603C105K4PAC-TU: MANUF: KEMET; DESCR: CAP 01U0 0603 16V X5R 10%; VENDOR: FARNELL INONE; VENDORCODE: 1463388; POPULATE: YES; VALUE_PF: 1000000; VOLTAGE: 16V; TOLERANCE: 0.1; MANUFCODE: C0603C105K4PAC-TU; PACKAGE: 0603; TECHNOLOGY: X5R
C611 = CL31A226KAHNNNE: MANUF: SAMSUNG; DESCR: CAP 22U0 1206 25V X5R 10%; VENDOR: MOUSER; VENDORCODE: 187-CL31A226KAHNNNE; POPULATE: YES; VALUE_PF: 22000000; VALUE: 22U0; VOLTAGE: 25V; TOLERANCE: 0.1; MANUFCODE: CL31A226KAHNNNE; PACKAGE: 1206; TECHNOLOGY: X5R
C612 C618 = C0603C105K3PAC: as C503 on sheet CAP_BANK; MANUFCODE: C0603C105K3PAC; PACKAGE: 0603; TECHNOLOGY: X5R
C613 = TAJC106K025RNJ: MANUF: AVX; DESCR: CAP 10U0 C 25V TANT 10%; VENDOR: FARNELL INONE; VENDORCODE: 197518; POPULATE: YES; VALUE_PF: 10000000; VALUE: 10U; VOLTAGE: 25V; TOLERANCE: 0.1; MANUFCODE: TAJC106K025RNJ; PACKAGE: C; TECHNOLOGY: TANT
C614 = GRM185R61C475KE11D: MANUF: MURATA; DESCR: CAP 04U7 0603 16V X5R 10%; VENDOR: DIGI-KEY; VENDORCODE: 490-14459-1-ND; POPULATE: YES; VALUE_PF: 4700000; VALUE: 04U7; VOLTAGE: 16V; TOLERANCE: 0.1; MANUFCODE: GRM185R61C475KE11D; PACKAGE: 603; TECHNOLOGY: X5R
C615 = 20SVPF56MX: MANUF: PANASONIC; DESCR: CAP 56U0 5X5.9 20V 20%; VENDOR: MOUSER; VENDORCODE: 667-20SVPF56MX; VALUE_PF: 56000000; VALUE: 56U; VOLTAGE: 20V; TOLERANCE: 0.2; MANUFCODE: 20SVPF56MX; PACKAGE: 5X5.9
C616 = C0603C105K3PAC: MANUF: KEMET; DESCR: CAP 01U0 0603 25V X5R 10%; VENDOR: FARNELL INONE; VENDORCODE: 1288202; VALUE_PF: 1000000; VALUE_4C: 01U0; VOLTAGE: 25V; TOLERANCE: 0.1; MANUFCODE: C0603C105K3PAC; PACKAGE: 0603; TECHNOLOGY: X5R
C617 = C0603C683K8RACTU: MANUF: KEMET; DESCR: CAP 68N0 0603 10V X7R 10%; VENDOR: DIGI-KEY; VENDORCODE: 399-9122-1-ND; POPULATE: YES; VALUE: 68N; VOLTAGE: 10V; TOLERANCE: 0.1; MANUFCODE: C0603C683K8RACTU; PACKAGE: 0603; TECHNOLOGY: X7R
C619-C621 = C3216X5R1E336M160AC: MANUF: TDK; DESCR: CAP 33U0 1206 25V X5R 20%; VENDOR: MOUSER; VENDORCODE: 810-C3216X5R1E336M; POPULATE: YES; VALUE_PF: 33000000; VALUE: 33U; VOLTAGE: 25V; TOLERANCE: 0.2; MANUFCODE: C3216X5R1E336M160AC; PACKAGE: 1206; TECHNOLOGY: X5R
C622 = 20SVPF56MX: MANUF: PANASONIC; DESCR: CAP 56U0 5X5.9 20V 20%; VENDOR: MOUSER; VENDORCODE: 667-20SVPF56MX; POPULATE: YES; VALUE_PF: 56000000; VALUE: 56U; VOLTAGE: 20V; TOLERANCE: 0.2; MANUFCODE: 20SVPF56MX; PACKAGE: 5X5.9
CON_PWR = 1711725: MANUF: PHOENIX CONTACT; DESCR: CON PHOENIX 5.08MM 2P SCREW; VENDOR: MOUSER; VENDORCODE: 651-1711725; POPULATE: YES; MANUFCODE: 1711725
D601 = RS2K-E3/52T: Default Diode; MANUF: VISHAY; DESCR: DIODE 800V 1.5A SMB; VENDOR: MOUSER; VENDORCODE: 625-RS2K-E3; POPULATE: YES; MANUFCODE: RS2K-E3/52T; QTY: SINGLE; PACKAGE: SMB
IC600 = MIC2954-03WS-TR: MANUF: MICROCHIP; DESCR: IC LDO 2-30VIN 5VOUT 250mA; VENDOR: MOUSER; VENDORCODE: 998-MIC2954-03WSTR; POPULATE: YES; MANUFCODE: MIC2954-03WS-TR
IC601 = TPS55289RYQR: MANUF: TI; DESCR: IC BUCK-BOOST 30V 8A I2C; VENDOR: MOUSER; VENDORCODE: 595-TPS55289RYQR; POPULATE: YES; MANUFCODE: TPS55289RYQR
L600 = SRN8040-4R7Y: MANUF: BOURNS; DESCR: INDUCTOR 04U7 4A1 R024 SMD; VENDOR: MOUSER; VENDORCODE: 652-SRN8040-4R7Y; POPULATE: YES; VALUE: 04U7; IMAX: 4A1; RESISTANCE: R024; MANUFCODE: SRN8040-4R7Y; TYPE: INDUCTOR
PWR = ASMT-RF45: MANUF: AVAGO TECHNOLOGIES; DESCR: LED GREEN 0603 20MA 2.4V 60MCD; VENDOR: FARNELL INONE; VENDORCODE: 1652078; POPULATE: YES; REMARK: GREEN; IF: 20MA; VF: 2.4V; INTENSITY: 60MCD; MANUFCODE: ASMT-RF45; QTY: SINGLE; COLOR: GREEN; PACKAGE: 0603
R600 = CRCW06034K70JNEAC: Resistor; MANUF: VISHAY; DESCR: RES 04K7 0603 0.1W 5% 75V 200PPM; VENDOR: DIGI-KEY; VENDORCODE: 541-3993-1-ND; POPULATE: YES; VALUE_MOHM: 4700000; VALUE: 04K7; POWER: 0.1W; TOLERANCE: 5%; VOLTAGE: 75V; TEMPCOEFF: 200PPM; NPOWER: 0.1; NTOLERANCE: 0.05; NVOLTAGE: 75; NTEMPCOEFF: 200; MANUFCODE: CRCW06034K70JNEAC; PACKAGE: 0603; NVALUE: 4700000
R601 = CRCW0603680KFKEA: Resistor; MANUF: VISHAY; DESCR: RES 680K 0603 0.1W 1% 75V 100PPM; VENDOR: DIGI-KEY; VENDORCODE: 541-680KHCT-ND; VALUE_MOHM: 680000000; VALUE: 680K; POWER: 0.1W; TOLERANCE: 1%; VOLTAGE: 75V; TEMPCOEFF: 100PPM; NPOWER: 0.1; NTOLERANCE: 0.01; NVOLTAGE: 75; NTEMPCOEFF: 100; MANUFCODE: CRCW0603680KFKEA; PACKAGE: 0603; NVALUE: 680000000
R602 = MC 0.063W 0603 1% 100K: Resistor; MANUF: MULTICOMP; DESCR: RES 100K 0603 0.063W 1% 50V 100PPM; VENDOR: FARNELL INONE; VENDORCODE: 9330402; POPULATE: YES; VALUE_MOHM: 100000000; VALUE: 100K; POWER: 0.063W; TOLERANCE: 1%; VOLTAGE: 50V; TEMPCOEFF: 100PPM; NPOWER: 0.063; NTOLERANCE: 0.01; NVOLTAGE: 50; NTEMPCOEFF: 100; MANUFCODE: MC 0.063W 0603 1% 100K; PACKAGE: 0603; NVALUE: 100000000
R603 = MC0063W0603110K5: Resistor; MANUF: MULTICOMP; DESCR: RES 10K5 0603 0.063W 1% 50V 100PPM; VENDOR: FARNELL INONE; VENDORCODE: 2130940; POPULATE: YES; VALUE_MOHM: 10500000; VALUE: 10K5; POWER: 0.063W; TOLERANCE: 1%; VOLTAGE: 50V; TEMPCOEFF: 100PPM; NPOWER: 0.063; NTOLERANCE: 0.01; NVOLTAGE: 50; NTEMPCOEFF: 100; MANUFCODE: MC0063W0603110K5; PACKAGE: 0603; NVALUE: 10500000
R604 = CRCW06030000Z0EA: Resistor; MANUF: VISHAY; DESCR: RES 000R 0603 0.1W 1% 75V 100PPM; VENDOR: DIGI-KEY; VENDORCODE: 541-0.0GTR-ND; POPULATE: YES; VALUE_MOHM: 0; VALUE: 000R; POWER: 0.1W; TOLERANCE: 1%; VOLTAGE: 75V; TEMPCOEFF: 100PPM; NPOWER: 0.1; NTOLERANCE: 0.01; NVOLTAGE: 75; NTEMPCOEFF: 100; MANUFCODE: CRCW06030000Z0EA; PACKAGE: 0603; NVALUE: 0
R605 = MC 0.063W 0603 1% 100K: Resistor; MANUF: MULTICOMP; DESCR: RES 100K 0603 0.063W 1% 50V 100PPM; VENDOR: FARNELL INONE; VENDORCODE: 9330402; VALUE_MOHM: 100000000; VALUE: 100K; POWER: 0.063W; TOLERANCE: 1%; VOLTAGE: 50V; TEMPCOEFF: 100PPM; NPOWER: 0.063; NTOLERANCE: 0.01; NVOLTAGE: 50; NTEMPCOEFF: 100; MANUFCODE: MC 0.063W 0603 1% 100K; PACKAGE: 0603; NVALUE: 100000000
R606 = CRCW060347K0FKEA: Resistor; MANUF: VISHAY; DESCR: RES 47K0 0603 0.1W 1% 75V 100PPM; VENDOR: DIGI-KEY; VENDORCODE: 541-47.0KHCT-ND; POPULATE: YES; VALUE_MOHM: 47000000; VALUE: 47K; POWER: 0.1W; TOLERANCE: 1%; VOLTAGE: 75V; TEMPCOEFF: 100PPM; NPOWER: 0.1; NTOLERANCE: 0.01; NVOLTAGE: 75; NTEMPCOEFF: 100; MANUFCODE: CRCW060347K0FKEA; PACKAGE: 0603; NVALUE: 47000000
R607 = CRCW06031K10FKEA: Resistor; MANUF: VISHAY; DESCR: RES 1K10 0603 0.1W 1% 75V 100PPM; VENDOR: DIGI-KEY; VENDORCODE: 541-1.10KHCT-ND; VALUE_MOHM: 1100000; VALUE: 1K1; POWER: 0.1W; TOLERANCE: 1%; VOLTAGE: 75V; TEMPCOEFF: 100PPM; NPOWER: 0.1; NTOLERANCE: 0.01; NVOLTAGE: 75; NTEMPCOEFF: 100; MANUFCODE: CRCW06031K10FKEA; PACKAGE: 0603; NVALUE: 1100000
R608 = MC 0.063W 0603 1% 4K99: Resistor; MANUF: MULTICOMP; DESCR: RES 4K99 0603 0.1W 1% 50V 100PPM; VENDOR: FARNELL INONE; VENDORCODE: 1170859; POPULATE: YES; VALUE_MOHM: 4990000; VALUE: 4K99; POWER: 0.063W; TOLERANCE: 1%; VOLTAGE: 50V; TEMPCOEFF: 100PPM; NPOWER: 0.063; NTOLERANCE: 0.01; NVOLTAGE: 50; NTEMPCOEFF: 100; MANUFCODE: MC 0.063W 0603 1% 4K99; PACKAGE: 0603; NVALUE: 4990000
TR600 = TMR 1-1212: MANUF: TRACO; DESCR: IC TR 9-18 VIN 12 VOUT REG ISO 1W; VENDOR: MOUSER; VENDORCODE: 495-TMR1-1212; POPULATE: YES
TR601 = TSR 0.5-2433: MANUF: TRACO; DESCR: IC TR 4.75-32 VIN 3.3 VOUT 0.5A; VENDOR: MOUSER; VENDORCODE: 495-TSR0.5-2433; POPULATE: YES
TR602 = TDU 1-1212: MANUF: TRACO; DESCR: IC TR 10.8-13.2 VIN 12 VOUT ISO 1W; VENDOR: MOUSER; VENDORCODE: 495-TDU1-1212; POPULATE: YES
XP600 = F05: MANUFCODE: F05; MANUF: XP POWER; DESCR: IC DCDC 0.8-12VIN 0-500 VOUT 10W; VENDOR: MOUSER; VENDORCODE: 209-F05; POPULATE: YES

## Sheet CTRL.SchDoc
size A4; DrawnBy: Jakov Sola; Organization: KU Leuven; SheetNumber: 2; SheetTotal: 6
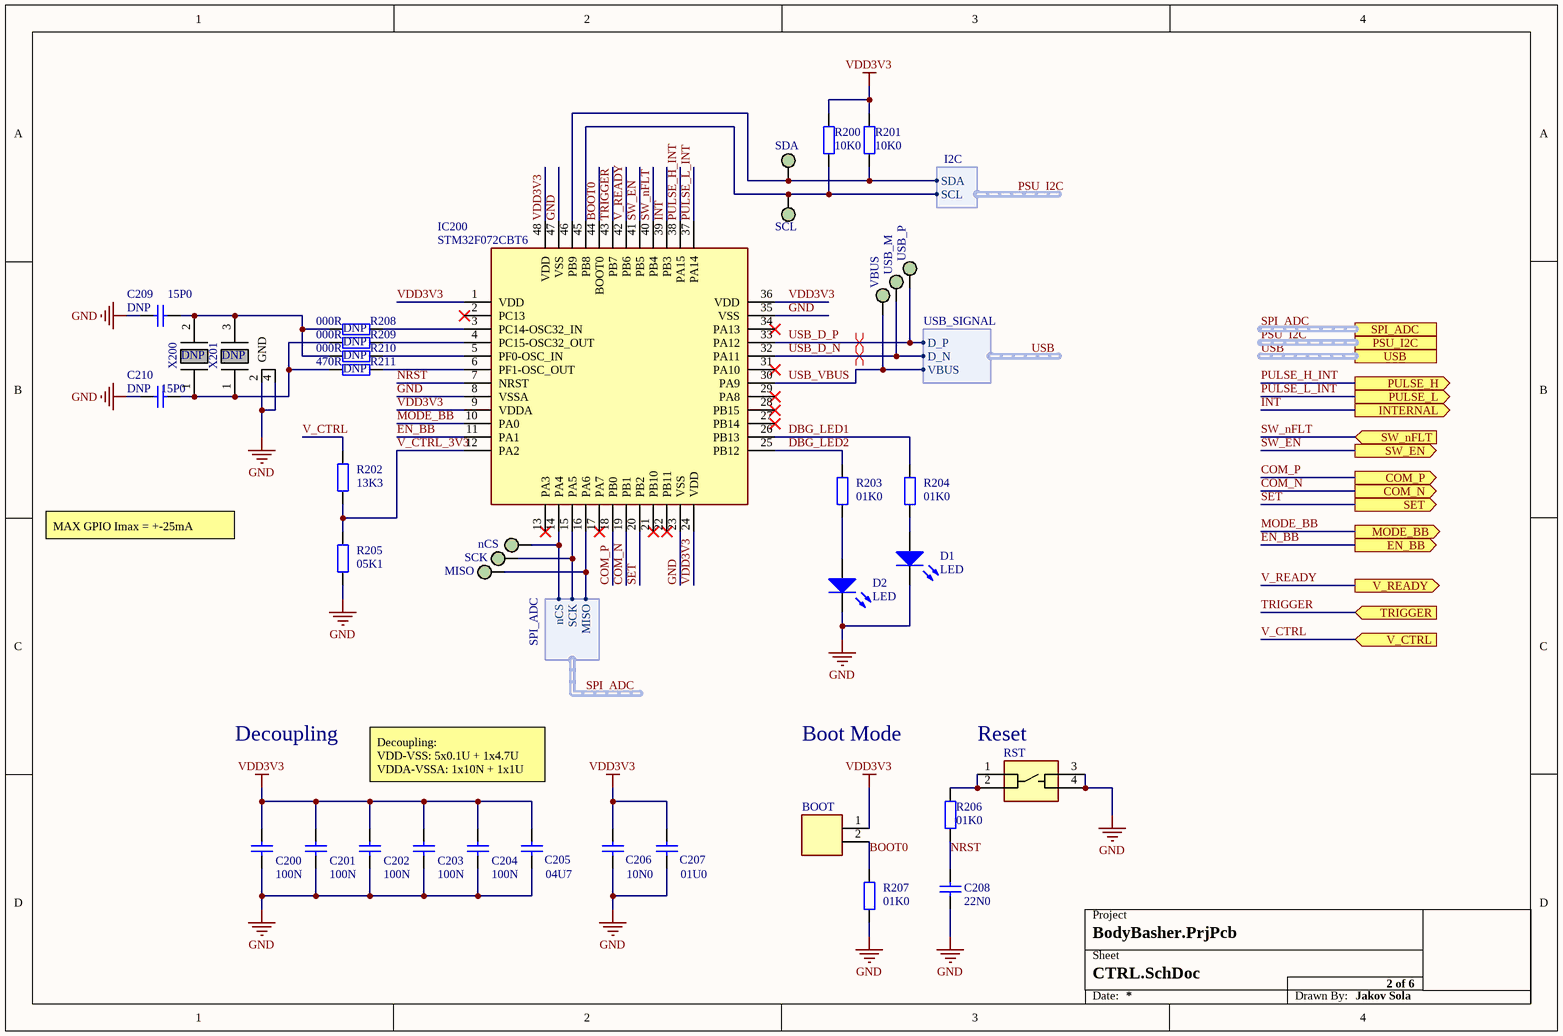
[diagram p4: CTRL.SchDoc]

### Parts
BOOT  CON_2P  [2MMHBS02VT02HTB]  (value not drawn)
C200  VALUE_4C: 100N  [CAPC0603N]  (hidden comment: Cap)
C201  VALUE_4C: 100N  [CAPC0603N]  (hidden comment: Cap)
C202  VALUE_4C: 100N  [CAPC0603N]  (hidden comment: Cap)
C203  VALUE_4C: 100N  [CAPC0603N]  (hidden comment: Cap)
C204  VALUE_4C: 100N  [CAPC0603N]  (hidden comment: Cap)
C205  VALUE_4C: 04U7  [CAPC1206N]  (hidden comment: Cap)
C206  VALUE_4C: 10N0  [CAPC0603N]  (hidden comment: Cap)
C207  VALUE_4C: 01U0  [CAPC0603N]  (hidden comment: Cap)
C208  VALUE_4C: 22N0  [CAPC0603N]  (hidden comment: Cap)
C209  POPULATE: DNP  VALUE_4C: 15P0  [CAPC0603N]  (hidden comment: Cap)
C210  POPULATE: DNP  VALUE_4C: 15P0  [CAPC0603N]  (hidden comment: Cap)
D1  LED  [LED0603_GREEN]
D2  LED  [LED0603_GREEN]
IC200  MANUFCODE: STM32F072CBT6  [LQFP48]  (hidden comment: STM32F0)
MISO  TP  [TP]  (value not drawn)
nCS  TP  [TP]  (value not drawn)
R200  VALUE_4C: 10K0  [RESC0603N]  (hidden comment: Res)
R201  VALUE_4C: 10K0  [RESC0603N]  (hidden comment: Res)
R202  VALUE_4C: 13K3  [RESC0603N]  (hidden comment: Res)
R203  VALUE_4C: 01K0  [RESC0603N]  (hidden comment: Res)
R204  VALUE_4C: 01K0  [RESC0603N]  (hidden comment: Res)
R205  VALUE_4C: 05K1  [RESC0603N]  (hidden comment: Res)
R206  VALUE_4C: 01K0  [RESC0603N]  (hidden comment: Res)
R207  VALUE_4C: 01K0  [RESC0603N]  (hidden comment: Res)
R208  POPULATE: DNP  VALUE_4C: 000R  [RESC0603N]  (hidden comment: Res)
R209  POPULATE: DNP  VALUE_4C: 000R  [RESC0603N]  (hidden comment: Res)
R210  POPULATE: DNP  VALUE_4C: 000R  [RESC0603N]  (hidden comment: Res)
R211  POPULATE: DNP  VALUE_4C: 470R  [RESC0603N]  (hidden comment: Res)
RST  4P_BTN  [FSM2J_1]  (value not drawn)
SCK  TP  [TP]  (value not drawn)
SCL  TP  [TP]  (value not drawn)
SDA  TP  [TP]  (value not drawn)
USB_M  TP  [TP]  (value not drawn)
USB_P  TP  [TP]  (value not drawn)
VBUS  TP  [TP]  (value not drawn)
X200  POPULATE: DNP  [XTAL_ABS07-32.768KHZ-7-T]  (hidden comment: CRY_2P)
X201  POPULATE: DNP  [FC3BAEBDI80T1]  (hidden comment: CRY_4P)

### Ports
COM_N (out), COM_P (out), EN_BB (out), INTERNAL (out), MODE_BB (out), PSU_I2C (harness I2C), PULSE_H (out), PULSE_L (out), SET (out), SPI_ADC (harness SPI_ADC), SW_EN (out), SW_nFLT (in), TRIGGER (in), USB (harness USB_SIGNAL), V_CTRL (in), V_READY (out)

### Harnesses
SPI_ADC: nCS, SCK, MISO
USB_SIGNAL: D_P, D_N, VBUS
I2C: SCL, SDA

### Nets
GND: C200.1 C201.1 C202.1 C203.1 C204.1 C205.1 C206.1 C207.1 C208.1 C209.1 C210.1 D1.2(K) D2.2(K) IC200.8(VSSA) IC200.23(VSS) IC200.35(VSS) IC200.47(VSS) R205.1 R207.1 RST.3 RST.4 X201.2(GND) X201.4(GND)
V_CTRL: R202.2 ; port V_CTRL
VDD3V3: BOOT.1 C200.2 C201.2 C202.2 C203.2 C204.2 C205.2 C206.2 C207.2 IC200.1(VDD) IC200.9(VDDA) IC200.24(VDD) IC200.36(VDD) IC200.48(VDD) R200.2 R201.2
BOOT0: BOOT.2 IC200.44(BOOT0) R207.2
COM_N: IC200.19(PB1) ; port COM_N
COM_P: IC200.18(PB0) ; port COM_P
DBG_LED1: IC200.26(PB13) R204.2
DBG_LED2: IC200.25(PB12) R203.2
EN_BB: IC200.11(PA1) ; port EN_BB
I2C.SCL: IC200.45(PB8) R200.1 SCL.TP ; port PSU_I2C.SCL
I2C.SDA: IC200.46(PB9) R201.1 SDA.TP ; port PSU_I2C.SDA
INT: IC200.39(PB3) ; port INTERNAL
MODE_BB: IC200.10(PA0) ; port MODE_BB
NRST: C208.2 IC200.7(NRST) R206.1
PULSE_H_INT: IC200.38(PA15) ; port PULSE_H  [project net PULSE_H]
PULSE_L_INT: IC200.37(PA14) ; port PULSE_L  [project net PULSE_L]
SET: IC200.20(PB2) ; port SET
SPI_ADC.MISO: IC200.16(PA6) MISO.TP ; port SPI_ADC.MISO
SPI_ADC.nCS: IC200.14(PA4) nCS.TP ; port SPI_ADC.nCS
SPI_ADC.SCK: IC200.15(PA5) SCK.TP ; port SPI_ADC.SCK
SW_EN: IC200.41(PB5) ; port SW_EN  [project net EN_SW]
SW_nFLT: IC200.40(PB4) ; port SW_nFLT  [project net nFLT]
TRIGGER: IC200.43(PB7) ; port TRIGGER  [project net TRIG]
USB_D_N: IC200.32(PA11) USB_M.TP ; port USB.D_N  [project net USB.D_N]
USB_D_P: IC200.33(PA12) USB_P.TP ; port USB.D_P  [project net USB.D_P]
USB_VBUS: IC200.30(PA9) VBUS.TP ; port USB.VBUS  [project net USB.VBUS]
V_CTRL_3V3: IC200.12(PA2) R202.1 R205.2
V_READY: IC200.42(PB6) ; port V_READY
NetC209_2: C209.2 R208.1 R210.1 X200.2(CRYSTAL_2) X201.3(CRYSTAL_2)
NetC210_2: C210.2 R209.1 R211.1 X200.1(CRYSTAL_1) X201.1(CRYSTAL_1)
NetD1_1: D1.1(A) R204.1
NetD2_1: D2.1(A) R203.1
NetIC200_3: IC200.3(PC14-OSC32_IN) R208.2
NetIC200_4: IC200.4(PC15-OSC32_OUT) R209.2
NetIC200_5: IC200.5(PF0-OSC_IN) R210.2
NetIC200_6: IC200.6(PF1-OSC_OUT) R211.2
NetR206_2: R206.2 RST.1 RST.2

Not connected (* = marked no-connect by the designer): IC200 2(PC13)* 13(PA3)* 17(PA7)* 21(PB10)* 22(PB11)* 27(PB14)* 28(PB15)* 29(PA8)* 31(PA10)* 34(PA13)*

### Buses and harness runs
harness PSU_I2C = port PSU_I2C
harness SPI_ADC = port SPI_ADC
harness USB = port USB

### Layout directives
differential pair: USB.D_N, USB.D_P

### Notes on the sheet
- MAX GPIO Imax = +-25mA
- Decoupling
- Decoupling:
  VDD-VSS: 5x0.1U + 1x4.7U
  VDDA-VSSA: 1x10N + 1x1U
- Boot Mode
- (near RST) Reset
- Project
- Sheet
- Date:
- Drawn By:

### Library data of the parts
BOOT = 2MM-HB-S02-VT-02-H-TB: as COM on sheet TOP; MANUFCODE: 2MM-HB-S02-VT-02-H-TB
C200-C204 = CL10B104KA8WPNC: as C400 on sheet SWITCHING; MANUFCODE: CL10B104KA8WPNC; PACKAGE: 0603; TECHNOLOGY: X7R
C205 = CL31B475KBHNNNE: MANUF: SAMSUNG; DESCR: CAP 04U7 1206 50V X7R 10%; VENDOR: FARNELL INONE; VENDORCODE: 3013533; POPULATE: YES; VALUE_PF: 4700000; VALUE: 04U7; VOLTAGE: 50V; TOLERANCE: 0.1; MANUFCODE: CL31B475KBHNNNE; PACKAGE: 1206; TECHNOLOGY: X7R
C206 = C0603C103K8RACTU: as C501 on sheet CAP_BANK; MANUFCODE: C0603C103K8RACTU; PACKAGE: 0603; TECHNOLOGY: X7R
C207 = C0603C105K4PAC-TU: as C606 on sheet PSU; MANUFCODE: C0603C105K4PAC-TU; PACKAGE: 0603; TECHNOLOGY: X5R
C208 = C0603C223K8RAC7867: MANUF: KEMET; DESCR: CAP 22N0 0603 10V X7R 10%; VENDOR: DIGI-KEY; VENDORCODE: 399-14505-1-ND; POPULATE: YES; VALUE: 22N; VOLTAGE: 10V; TOLERANCE: 0.1; MANUFCODE: C0603C223K8RAC7867; PACKAGE: 0603; TECHNOLOGY: X7R
C209 C210 = C0603C150K8RAC: MANUF: KEMET; DESCR: CAP 15P0 0603 10V X7R 10%; VALUE_PF: 15; VALUE: 15P; VOLTAGE: 10V; TOLERANCE: 0.1; MANUFCODE: C0603C150K8RAC; PACKAGE: 0603; TECHNOLOGY: X7R
D1 D2 = ASMT-RF45: as PWR on sheet PSU; MANUFCODE: ASMT-RF45; QTY: SINGLE; COLOR: GREEN; PACKAGE: 0603
IC200 = STM32F072CBT6: MANUF: STM; DESCR: IC MCU ARM CORTEX-M0 128KB 48MHZ USB; VENDOR: FARNELL; VENDORCODE: 2432094; POPULATE: YES
MISO nCS SCK SCL SDA USB_M USB_P VBUS = TP: DESCR: TESTPOINT 1.5MM; POPULATE: NA; MANUFCODE: TP
R200 R201 = CRCW060310K0FKEA: Resistor; MANUF: VISHAY; DESCR: RES 10K0 0603 0.1W 1% 75V 100PPM; VENDOR: DIGI-KEY; VENDORCODE: 541-10.0KHCT-ND; POPULATE: YES; VALUE_MOHM: 10000000; VALUE: 10K; POWER: 0.1W; TOLERANCE: 1%; VOLTAGE: 75V; TEMPCOEFF: 100PPM; NPOWER: 0.1; NTOLERANCE: 0.01; NVOLTAGE: 75; NTEMPCOEFF: 100; MANUFCODE: CRCW060310K0FKEA; PACKAGE: 0603; NVALUE: 10000000
R202 = CRCW060313K3FKEA: Resistor; MANUF: VISHAY; DESCR: RES 13K3 0603 0.1W 1% 75V 100PPM; VENDOR: FARNELL INONE; VENDORCODE: 1652840; POPULATE: YES; VALUE_MOHM: 13300000; VALUE: 13K3; POWER: 0.1W; TOLERANCE: 1%; VOLTAGE: 75V; TEMPCOEFF: 100PPM; NPOWER: 0.1; NTOLERANCE: 0.01; NVOLTAGE: 75; NTEMPCOEFF: 100; MANUFCODE: CRCW060313K3FKEA; PACKAGE: 0603; NVALUE: 13300000
R203 R204 R206 R207 = MC 0.063W 0603 1% 1K: Resistor; MANUF: MULTICOMP; DESCR: RES 01K0 0603 0.063W 1% 50V 100PPM; VENDOR: FARNELL INONE; VENDORCODE: 9330380; POPULATE: YES; VALUE_MOHM: 1000000; VALUE: 1K; POWER: 0.063W; TOLERANCE: 1%; VOLTAGE: 50V; TEMPCOEFF: 100PPM; NPOWER: 0.063; NTOLERANCE: 0.01; NVOLTAGE: 50; NTEMPCOEFF: 100; MANUFCODE: MC 0.063W 0603 1% 1K; PACKAGE: 0603; NVALUE: 1000000
R205 = RC0603FR-075K1L: Resistor; MANUF: YAGEO; DESCR: RES 05K1 0603 0.1W 1% 75V 100PPM; VENDOR: DIGI-KEY; VENDORCODE: 311-5.10KHRCT-ND; POPULATE: YES; VALUE_MOHM: 5100000; VALUE: 5K1; POWER: 0.1W; TOLERANCE: 1%; VOLTAGE: 75V; TEMPCOEFF: 100PPM; NVOLTAGE: 75; NTEMPCOEFF: 100; MANUFCODE: RC0603FR-075K1L; PACKAGE: 603; NVALUE: 5100000
R208-R210 = CRCW06030000Z0EA: Resistor; MANUF: VISHAY; DESCR: RES 000R 0603 0.1W 1% 75V 100PPM; VENDOR: DIGI-KEY; VENDORCODE: 541-0.0GTR-ND; VALUE_MOHM: 0; VALUE: 000R; POWER: 0.1W; TOLERANCE: 1%; VOLTAGE: 75V; TEMPCOEFF: 100PPM; NPOWER: 0.1; NTOLERANCE: 0.01; NVOLTAGE: 75; NTEMPCOEFF: 100; MANUFCODE: CRCW06030000Z0EA; PACKAGE: 0603; NVALUE: 0
R211 = ERA3AEB471V: Resistor; MANUF: PANASONIC; DESCR: RES 470R 0603 0.1W 0.1% 75V 25PPM; VENDOR: FARNELL INONE; VENDORCODE: 1577601; VALUE_MOHM: 470000; VALUE: 470R; POWER: 0.1W; TOLERANCE: 0.1%; VOLTAGE: 75V; TEMPCOEFF: 25PPM; NPOWER: 0.1; NTOLERANCE: 0.001; NVOLTAGE: 75; NTEMPCOEFF: 25; MANUFCODE: ERA3AEB471V; PACKAGE: 0603; NVALUE: 470000
RST = FSM2JSMAATR: MANUF: TE CONNECTIVITY; DESCR: BTN 24V 4P SMD; VENDOR: MOUSER; VENDORCODE: 506-FSM2JSMAATR; POPULATE: YES; MANUFCODE: FSM2JSMAATR
X200 = ABS07-32.768KHZ-7-T: MANUF: ABRACON; DESCR: CRYSTAL 32.768KHZ 7PF 20PPM SMD; VENDOR: MOUSER; VENDORCODE: 815-ABS07-32.768K7T; MANUFCODE: ABS07-32.768KHZ-7-T
X201 = FC3BAEBDI8.0-T1: MANUF: ABRACON; DESCR: CRYSTAL 8MHZ 8PF 20PPM SMD; VENDOR: MOUSER; VENDORCODE: 815-FC3BAEBDI8.0-T1; MANUFCODE: FC3BAEBDI8.0-T1

## Sheet PULSE_MUX.SchDoc
size A4; DrawnBy: Jakov Sola; SheetNumber: 3; SheetTotal: 6
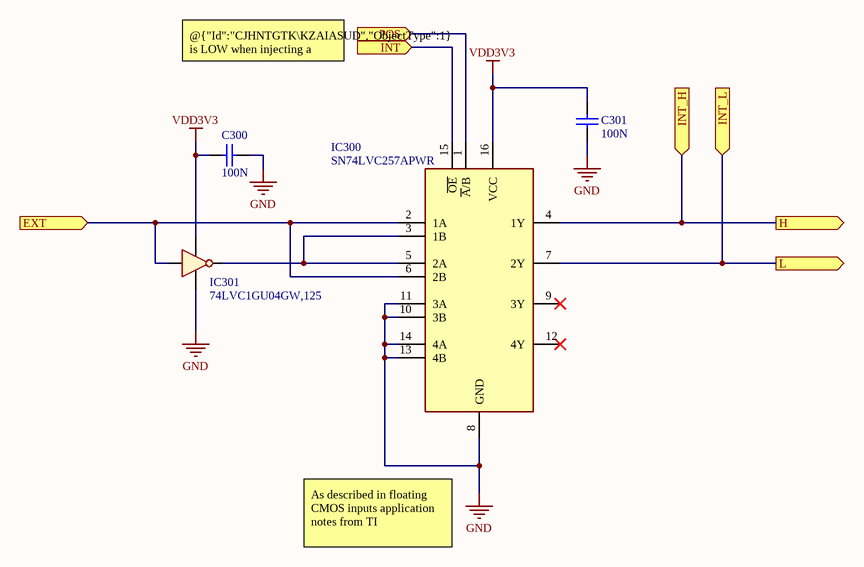
[diagram p5: PULSE_MUX.SchDoc]

### Parts
C300  VALUE_4C: 100N  [CAPC0603N]  (hidden comment: Cap)
C301  VALUE_4C: 100N  [CAPC0603N]  (hidden comment: Cap)
IC300  SN74LVC257APWR  [SOP65P640X120-16N]
IC301  MANUFCODE: 74LVC1GU04GW,125  [SOT65P212X110-5N]  (hidden comment: INV_SINGLE)

### Ports
EXT (in), H (out), INT (in), INT_H (in), INT_L (in), L (out), POS (in)

### Nets
GND: C300.1 C301.1 IC300.8(GND) IC300.10(3B) IC300.11(3A) IC300.13(4B) IC300.14(4A) IC301.3(GND)
VDD3V3: C300.2 C301.2 IC300.16(VCC) IC301.5(GND)
COM_P: IC300.1(~{A}/B) ; port POS
INT: IC300.15(~{OE}) ; port INT
PULSE_EXT: IC300.2(1A) IC300.6(2B) IC301.2(A) ; port EXT
PULSE_H: IC300.4(1Y) ; port INT_H, port H
PULSE_L: IC300.7(2Y) ; port INT_L, port L
NetIC300_3: IC300.3(1B) IC300.5(2A) IC301.4(Y)

Not connected (* = marked no-connect by the designer): IC300 9(3Y)* 12(4Y)*

### Notes on the sheet
- @{"Id":"CJHNTGTK\KZAIASUD","ObjectType":1} is LOW when injecting a POSITIVE pulse
- As described in floating CMOS inputs application notes from TI
- Project
- Sheet
- Date:
- Drawn By:

### Library data of the parts
C300 C301 = CL10B104KA8WPNC: as C400 on sheet SWITCHING; MANUFCODE: CL10B104KA8WPNC; PACKAGE: 0603; TECHNOLOGY: X7R
IC300 = SN74LVC257APWR: MANUF: TI; DESCR: IC MUX QUAD 2:1 3 STATE; VENDOR: MOUSER; VENDORCODE: 595-SN74LVC257APWR; POPULATE: YES; MANUFCODE: SN74LVC257APWR
IC301 = 74LVC1GU04GW,125: MANUF: NEXPERIA; DESCR: IC INV SINGLE UNBUFFERED; VENDOR: MOUSER; VENDORCODE: 771-LVC1GU04GW125; POPULATE: YES

## Nets that join several sheets
+VBST: SWITCHING (C402.2 IC402.38), PSU (TR602.5)
AGND: SWITCHING (21 pins), CAP_BANK (19 pins), PSU (12 pins)
COM: TOP (R105.1), SWITCHING (IC403.3 IC404.4)
GND: TOP (8 pins), SWITCHING (8 pins), PSU (27 pins), CTRL (23 pins), PULSE_MUX (8 pins)
HV: CAP_BANK (IC500.8 R501.2 R_BLEED.2), PSU (D601.2)
HV_P: SWITCHING (12 pins), CAP_BANK (12 pins)
SW: TOP (PIN.1), SWITCHING (7 pins), PSU (TR602.7)
V_CTRL: PSU (12 pins), CTRL (R202.2)
VDD3V3: SWITCHING (C400.2 C404.2 IC400.1 IC401.1), CAP_BANK (R500.2), PSU (3V3.TP C603.2 TR601.3), CTRL (16 pins), PULSE_MUX (C300.2 C301.2 IC300.16 IC301.5)
VDD5V: SWITCHING (C401.1 C405.1 IC400.16 IC401.16), CAP_BANK (6 pins), PSU (5V.TP C605.2 C606.2 IC600.3)
VDD12V: SWITCHING (C403.2 IC402.35), PSU (7 pins)
COM_N: SWITCHING (COM_N.TP R404.2), CTRL (IC200.19)
COM_P: SWITCHING (COM_P.TP R403.2), CTRL (IC200.18), PULSE_MUX (IC300.1)
EN_BB: PSU (R604.1), CTRL (IC200.11)
EN_SW: SWITCHING (EN_SW.TP IC400.5), CTRL (IC200.41)
I2C.SCL: PSU (IC601.3), CTRL (IC200.45 R200.1 SCL.TP)
I2C.SDA: PSU (IC601.4), CTRL (IC200.46 R201.1 SDA.TP)
INT: CTRL (IC200.39), PULSE_MUX (IC300.15)
MODE_BB: PSU (EN_MD.TP IC601.2), CTRL (IC200.10)
nFLT: SWITCHING (IC401.6 nFLT.TP), CTRL (IC200.40)
PULSE_EXT: TOP (PULSE.2), PULSE_MUX (IC300.2 IC300.6 IC301.2)
PULSE_H: SWITCHING (IC401.3), CTRL (IC200.38), PULSE_MUX (IC300.4)
PULSE_L: SWITCHING (IC401.4), CTRL (IC200.37), PULSE_MUX (IC300.7)
SET: CAP_BANK (IC500.3 SET.TP), CTRL (IC200.20)
SPI_ADC.MISO: SWITCHING (IC400.6), CTRL (IC200.16 MISO.TP)
SPI_ADC.nCS: SWITCHING (IC400.3), CTRL (IC200.14 nCS.TP)
SPI_ADC.SCK: SWITCHING (IC400.4), CTRL (IC200.15 SCK.TP)
SPI_ADC_ISO.CLK: SWITCHING (IC400.13), CAP_BANK (IC501.4)
SPI_ADC_ISO.DATA: SWITCHING (IC400.11), CAP_BANK (IC501.5)
SPI_ADC_ISO.nCS: SWITCHING (IC400.14), CAP_BANK (IC501.6)
TRIG: TOP (TRIG.2), CTRL (IC200.43)
USB.D_N: TOP (R101.1 TVS100.5), CTRL (IC200.32 USB_M.TP)
USB.D_P: TOP (R102.1 TVS100.4), CTRL (IC200.33 USB_P.TP)
USB.VBUS: TOP (R100.2 R103.2 TVS100.3), CTRL (IC200.30 VBUS.TP)
V_READY: TOP (V_READY.2), CTRL (IC200.42)